# Altium schematic sheet usb.SchDoc
size A4
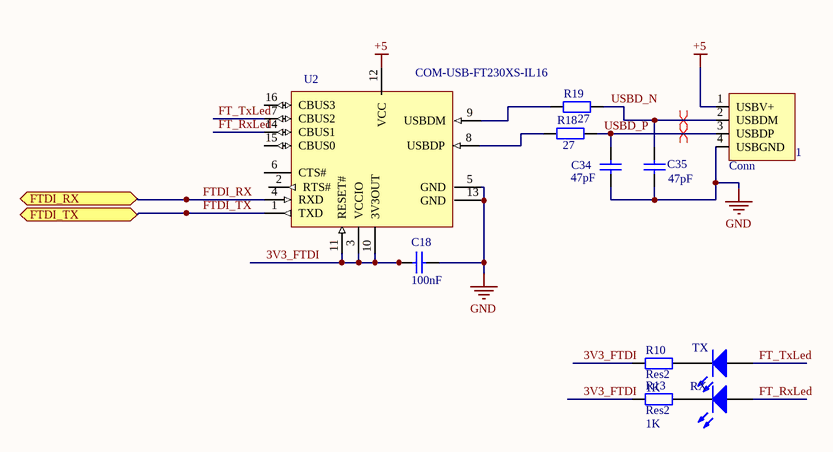
[diagram p0: usb.SchDoc]

## Parts
C18  value 100nF  [CAPC2012M]  (hidden comment: Cap)
C34  value 47pF  [CAPC1005M]  (hidden comment: Cap)
C35  value 47pF  [CAPC1005M]  (hidden comment: Cap)
CN1  Conn  AC Magnitude: 1  [USB2.5-2H4D]
R10  Res2  value 1K  [RESC2012M]
R13  Res2  value 1K  [RESC2012M]
R18  value 27  [RESC2012M]  (hidden comment: Res)
R19  value 27  [RESC2012M]  (hidden comment: Res)
RX  led  [RESC2012M]  (value not drawn)
TX  led  [RESC2012M]  (value not drawn)
U2  COM-USB-FT230XS-IL16  [SSOP-16_M]

## Ports
FTDI_RX, FTDI_TX

## Nets
+5: CN1.1(USBV+) U2.12(VCC)
GND: C18.2 C34.1 C35.1 CN1.4(USBGND) U2.5(GND) U2.13(GND)
3V3_FTDI: C18.1 R10.1 R13.1 U2.3(VCCIO) U2.10(3V3OUT) U2.11(RESET#)
FT_RxLed: RX.1(A) U2.14(CBUS1)
FT_TxLed: TX.1(A) U2.7(CBUS2)
FTDI_RX: U2.4(RXD) ; port FTDI_RX
FTDI_TX: U2.1(TXD) ; port FTDI_TX
USBD_N: C35.2 CN1.2(USBDM) R19.2
USBD_P: C34.2 CN1.3(USBDP) R18.2
NetR10_2: R10.2 TX.2(K)
NetR13_2: R13.2 RX.2(K)
NetR18_1: R18.1 U2.8(USBDP)
NetR19_1: R19.1 U2.9(USBDM)

Not connected (* = marked no-connect by the designer): U2 2(RTS#) 6(CTS#) 15(CBUS0) 16(CBUS3)

## Layout directives
differential pair: USBD_N, USBD_P

## Library data of the parts
C18 C34 C35 = Cap: Capacitor; Published: 8-Jun-2000; LatestRevisionDate: 17-Jul-2002; LatestRevisionNote: Re-released for DXP Platform.; PackageReference: RAD-0.3; Publisher: Altium Limited; PackageDescription: Radial Cap, Thru-Hole; 2 Leads; 0.3 in Pin Spacing
CN1 = USBB-1J: url: http://www.brownbear.ru/components/usbb-1j.html
R10 R13 R18 R19 = Res2: Resistor; Published: 8-Jun-2000; LatestRevisionDate: 17-Jul-2002; LatestRevisionNote: Re-released for DXP Platform.; PackageReference: AXIAL-0.4; Publisher: Altium Limited; PackageDescription: Axial Device, Thru-Hole; 2 Leads; 0.4 in Pin Spacing
RX TX = chip led
U2 = COM-USB-FT230XS-IL16: FTDI FT230XS